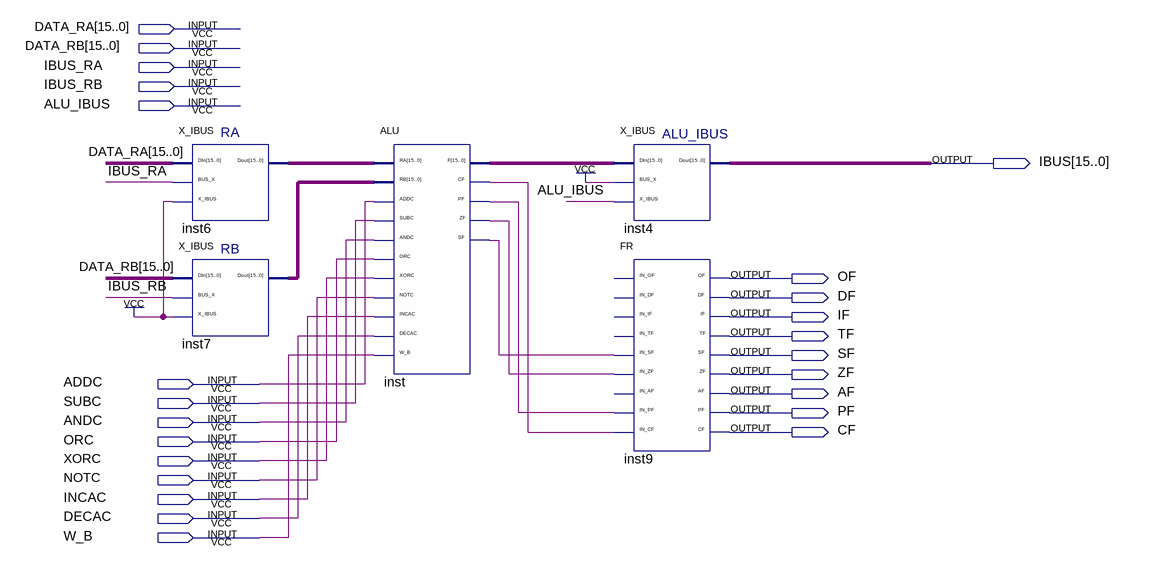
[diagram p0: schematic sheet]
// Quartus schematic ALU_test.bdf as structural Verilog: 5 symbols, 24 pins
module ALU_test (
  input  [15:0] DATA_RA,
  input  [15:0] DATA_RB,
  input  IBUS_RA,
  input  IBUS_RB,
  input  ALU_IBUS,
  input  ADDC,
  input  SUBC,
  input  ANDC,
  input  ORC,
  input  XORC,
  input  NOTC,
  input  INCAC,
  input  DECAC,
  input  W_B,
  output [15:0] IBUS,
  output OF,
  output DF,
  output IF,
  output TF,
  output SF,
  output ZF,
  output AF,
  output PF,
  output CF
);

  wire inst_cf, inst_pf, inst_sf, inst_zf;
  wire [15:0] inst6_dout, inst7_dout, inst_f;

  X_IBUS inst6 (.DIn(DATA_RA), .BUS_X(IBUS_RA), .X_IBUS(1'b1), .Dout(inst6_dout));
  X_IBUS inst7 (.DIn(DATA_RB), .BUS_X(IBUS_RB), .X_IBUS(1'b1), .Dout(inst7_dout));
  ALU inst (
    .RA(inst6_dout), .RB(inst7_dout), .ADDC(ADDC), .SUBC(SUBC), .ANDC(ANDC), .ORC(ORC), .XORC(XORC),
    .NOTC(NOTC), .INCAC(INCAC), .DECAC(DECAC), .W_B(W_B), .F(inst_f), .CF(inst_cf), .PF(inst_pf),
    .ZF(inst_zf), .SF(inst_sf));
  X_IBUS inst4 (.DIn(inst_f), .BUS_X(1'b1), .X_IBUS(ALU_IBUS), .Dout(IBUS));
  FR inst9 (
    .IN_SF(inst_sf), .IN_ZF(inst_zf), .IN_PF(inst_pf), .IN_CF(inst_cf), .OF(OF), .DF(DF), .IF(IF), .TF(TF),
    .SF(SF), .ZF(ZF), .AF(AF), .PF(PF), .CF(CF));  // open: IN_OF, IN_DF, IN_IF, IN_TF, IN_AF
endmodule
